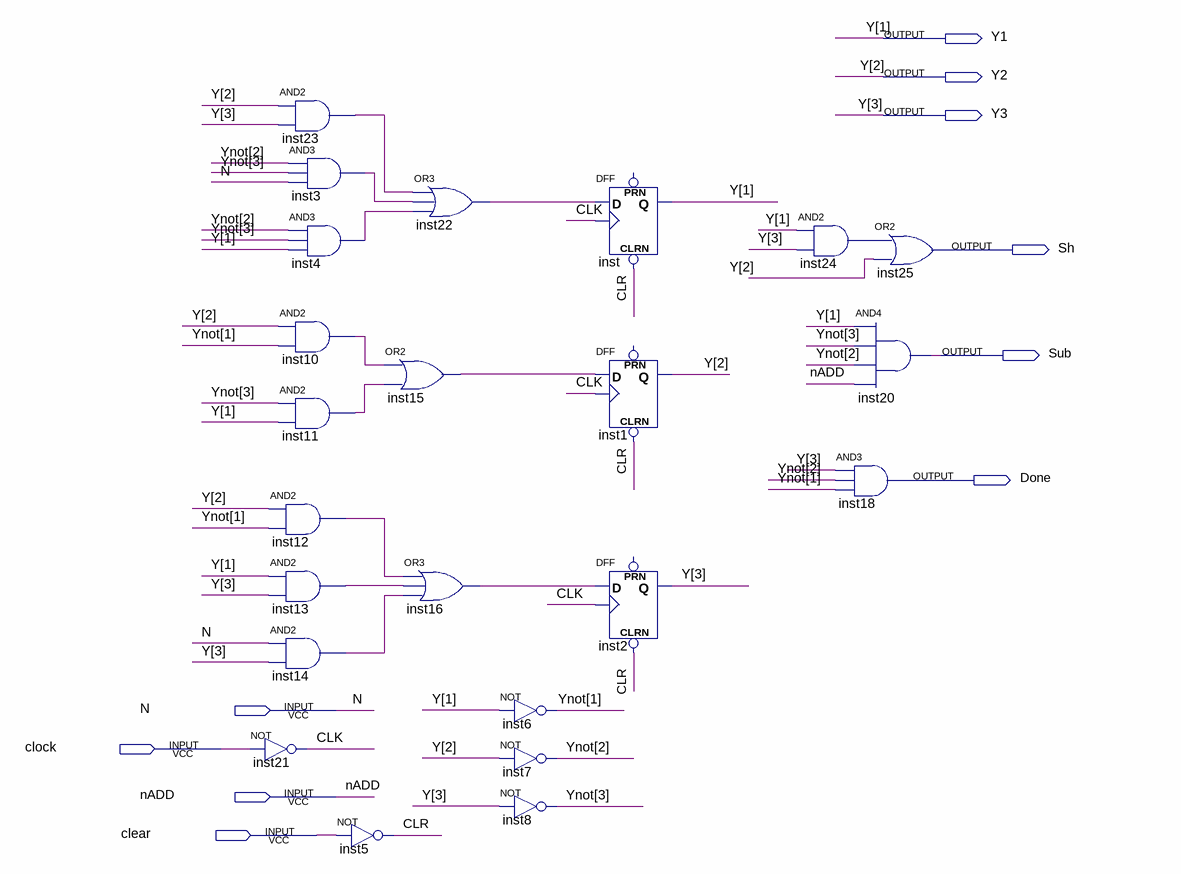
[diagram p0: schematic sheet]
// Quartus schematic ControlFSM.bdf as structural Verilog: 23 symbols, 10 pins
module ControlFSM (
  input  N,
  input  clock,
  input  nADD,
  input  clear,
  output Y1,
  output Y2,
  output Y3,
  output Sh,
  output Sub,
  output Done
);

  wire CLK, CLR, inst3_out, inst4_out, inst10_out, inst11_out, inst12_out, inst13_out, inst14_out,
       inst15_out, inst16_out, inst22_out, inst23_out, inst24_out;
  wire [3:1] Ynot;

  not inst21 (CLK, clock);
  and inst23 (inst23_out, Y2, Y3);
  and inst3 (inst3_out, Ynot[2], Ynot[3], N);
  and inst4 (inst4_out, Ynot[2], Ynot[3], Y1);
  and inst10 (inst10_out, Y2, Ynot[1]);
  and inst11 (inst11_out, Ynot[3], Y1);
  and inst12 (inst12_out, Y2, Ynot[1]);
  and inst13 (inst13_out, Y1, Y3);
  and inst14 (inst14_out, N, Y3);
  or inst15 (inst15_out, inst10_out, inst11_out);
  or inst16 (inst16_out, inst12_out, inst13_out, inst14_out);
  not inst5 (CLR, clear);
  or inst22 (inst22_out, inst23_out, inst3_out, inst4_out);
  not inst6 (Ynot[1], Y1);
  not inst7 (Ynot[2], Y2);
  not inst8 (Ynot[3], Y3);
  DFF inst (.CLRN(CLR), .CLK(CLK), .D(inst22_out), .Q(Y1));  // open: PRN
  DFF inst1 (.CLRN(CLR), .CLK(CLK), .D(inst15_out), .Q(Y2));  // open: PRN
  DFF inst2 (.CLRN(CLR), .CLK(CLK), .D(inst16_out), .Q(Y3));  // open: PRN
  and inst24 (inst24_out, Y1, Y3);
  and inst20 (Sub, Y1, Ynot[3], Ynot[2], nADD);
  and inst18 (Done, Y3, Ynot[2], Ynot[1]);
  or inst25 (Sh, inst24_out, Y2);
endmodule
